# Altium project Luna v2.PrjPcb (part 1 of 7)
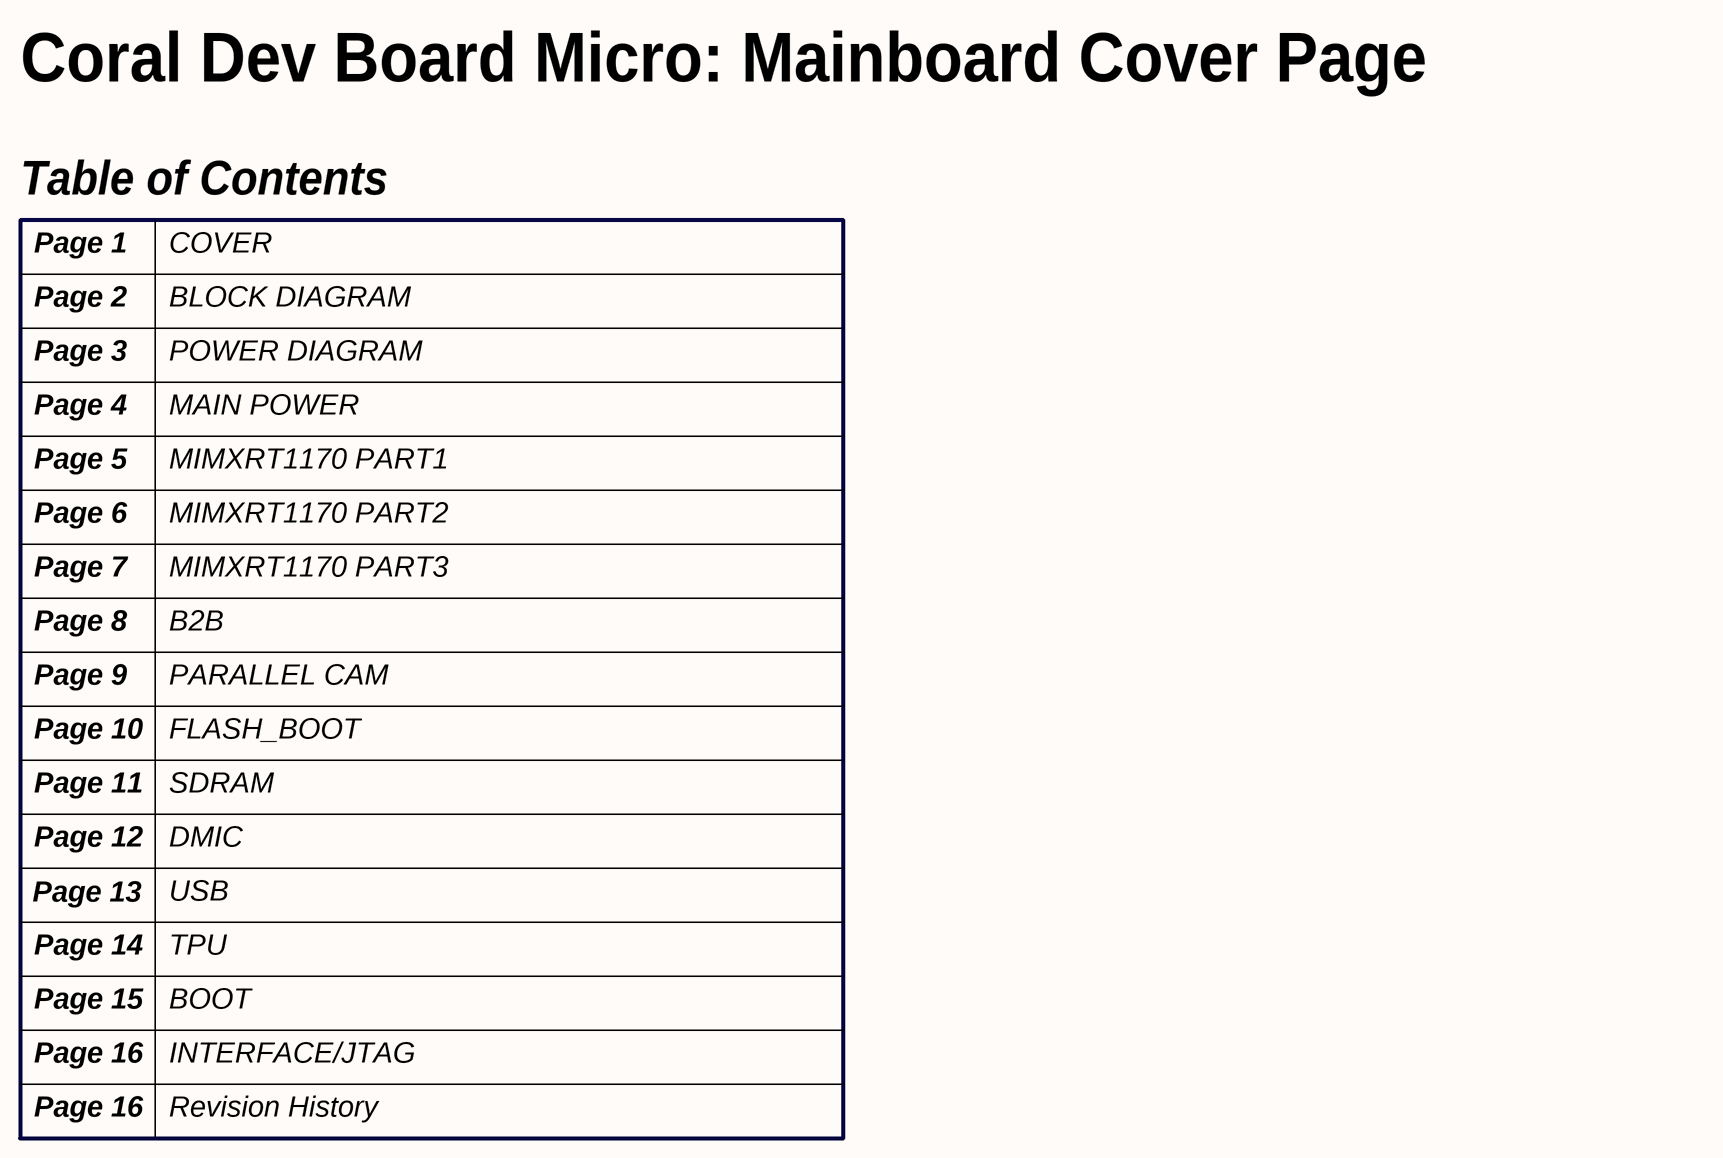
[diagram p0: 01 COVER.SchDoc]
ProjectRevision: PVT; Title: Luna v2
20 sheets, 413 parts. Net scope: flat (ports and power ports of the same name join across sheets).
Board file: Coral Dev Board Micro.PcbDoc
Sheets:
  01 COVER.SchDoc
  02 BLOCK DIAGRAM.SchDoc
  03 POWER DIAGRAM.SchDoc
  Analog Sense.SchDoc
  04 MAIN POWER.SchDoc
  05 MIMXRT1170 PART1.SchDoc
  06 MIMXRT1170 PART2.SchDoc
  07 MIMXRT1170 PART3.SchDoc
  08 B2B.SchDoc
  09 Parallel Camera.SchDoc
  10 FLASH_BOOT.SchDoc
  11 SDRAM.SchDoc
  12 DMIC.SchDoc
  13 USB.SchDoc
  14 TPU.SchDoc
  15 BOOT.SchDoc
  16 INTERFACE.SchDoc
  17 Revision History.SchDoc
  POWER.SchDoc
  Heater.SchDoc

## Sheet 01 COVER.SchDoc: Luna v2
size A2; VersionControl_RevNumber: DNP; IsUserConfigurable: DNP; OrgAddr3: Sunrise FL 33323; OrgName: Pixels on Target; Page Create Date: March  8, 1995; Page Number: 5; Page Size: A2; Page Count: 14; OrgAddr2: Suite #104; RevCode: A; Doc: SCH30-00070-00; DsnPath: C:\Users\Carter Nichols\Documents\BitBucket boards (Cadence)\30-00070-00_Original\SCH30-00070-00.DSN; SchematicName: SC30-00070-00; PageName: 05-POWER IN; PageSize: A2; TopSchematic: True; Address4: United States

### Notes on the sheet
- Coral Dev Board Micro: Mainboard Cover Page
- Table of Contents
- Page 1
- Page 2
- COVER
- BLOCK DIAGRAM
- Page 3
- POWER DIAGRAM
- Page 4
- MAIN POWER
- Page 5
- MIMXRT1170 PART1
- Page 6
- Page 7
- MIMXRT1170 PART3
- MIMXRT1170 PART2
- Page 8
- B2B
- Page 9
- PARALLEL CAM
- Page 10
- FLASH_BOOT
- Page 11
- Page 12
- SDRAM
- DMIC
- Page 13
- USB
- Page 14
- TPU
- Page 15
- BOOT
- Page 16
- INTERFACE/JTAG
- Revision History
- Title
- Size:
- Date:
- File:
- A2
- Number:
- Time:
- Revision:
- Sheet
- of

## Sheet 02 BLOCK DIAGRAM.SchDoc: Luna v2
size A2; VersionControl_RevNumber: DNP; IsUserConfigurable: DNP; OrgAddr3: Sunrise FL 33323; OrgName: Pixels on Target; Page Create Date: March  8, 1995; Page Number: 5; Page Size: A2; Page Count: 14; OrgAddr2: Suite #104; RevCode: A; Doc: SCH30-00070-00; DsnPath: C:\Users\Carter Nichols\Documents\BitBucket boards (Cadence)\30-00070-00_Original\SCH30-00070-00.DSN; SchematicName: SC30-00070-00; PageName: 05-POWER IN; PageSize: A2; TopSchematic: True; Address4: United States
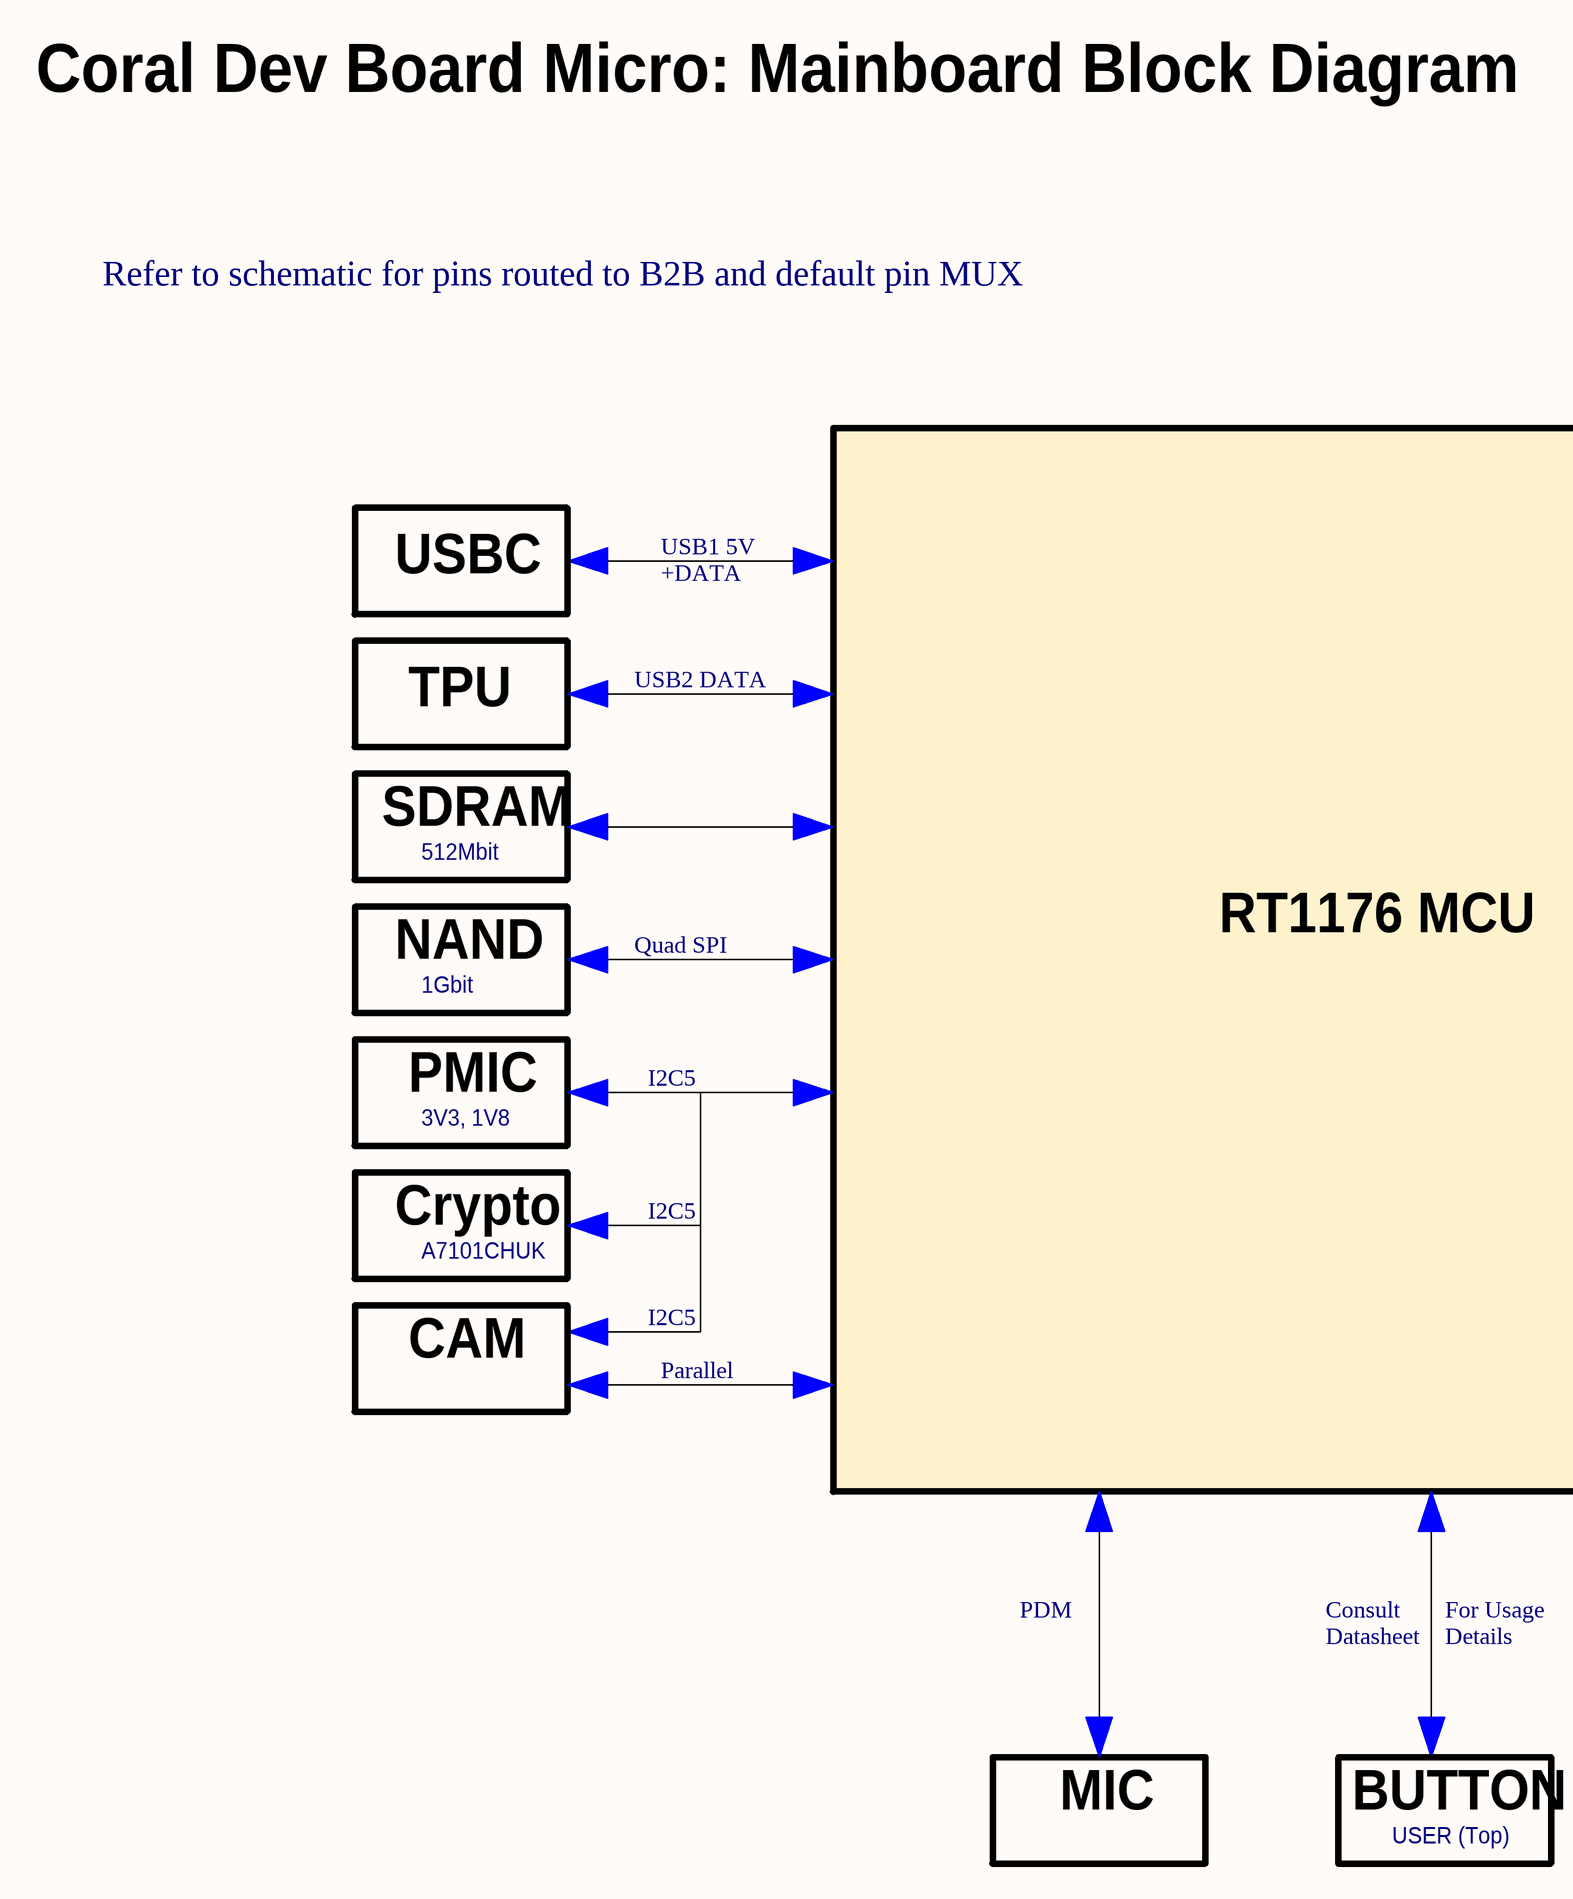
[diagram p1: 02 BLOCK DIAGRAM.SchDoc, left]
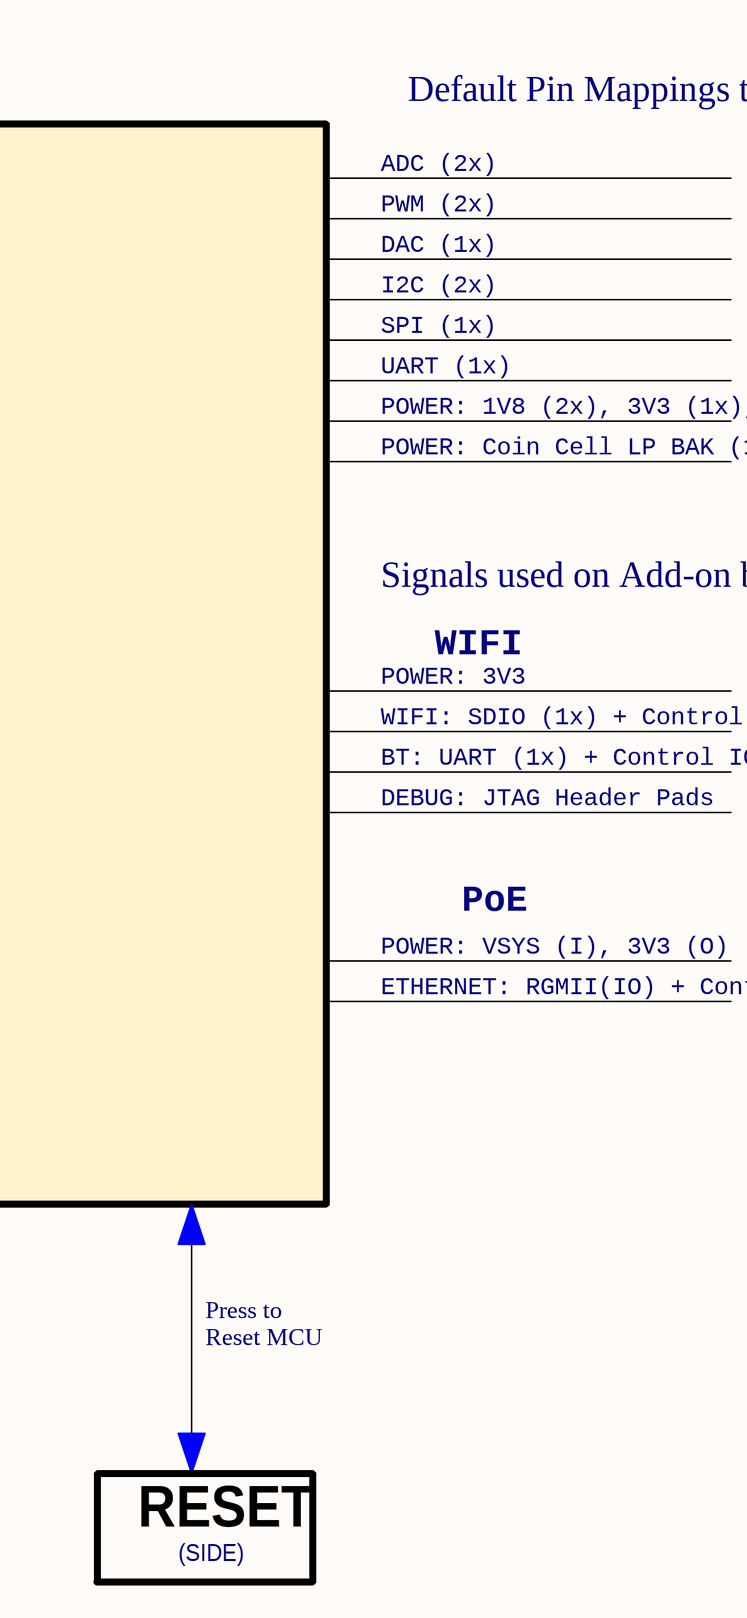
[diagram p2: 02 BLOCK DIAGRAM.SchDoc, right]

### Notes on the sheet
- Coral Dev Board Micro: Mainboard Block Diagram
- Refer to schematic for pins routed to B2B and default pin MUX
- Default Pin Mappings to Header
- ADC (2x)
- PWM (2x)
- USBC
- USB1 5V
- +DATA
- DAC (1x)
- I2C (2x)
- SPI (1x)
- TPU
- USB2 DATA
- UART (1x)
- POWER: 1V8 (2x), 3V3 (1x), VSYS 5V (1x)
- POWER: Coin Cell LP BAK (1x)
- SDRAM
- 512Mbit
- Signals used on Add-on boards at Release Time
- NAND
- Quad SPI
- RT1176 MCU
- POWER: 3V3
- WIFI
- 1Gbit
- WIFI: SDIO (1x) + Control IO
- PMIC
- I2C5
- BT: UART (1x) + Control IO
- DEBUG: JTAG Header Pads
- 3V3, 1V8
- Crypto
- POWER: VSYS (I), 3V3 (O)
- PoE
- A7101CHUK
- ETHERNET: RGMII(IO) + Control IO
- CAM
- Parallel
- PDM
- Consult
- Datasheet
- For Usage
- Details
- Press to
- Reset MCU
- MIC
- BUTTON
- USER (Top)
- RESET
- (SIDE)
- Title
- Size:
- Date:
- File:
- A2
- Number:
- Time:
- Revision:
- Sheet
- of

## Sheet 03 POWER DIAGRAM.SchDoc: Luna v2
size A2; VersionControl_RevNumber: DNP; IsUserConfigurable: DNP; OrgAddr3: Sunrise FL 33323; OrgName: Pixels on Target; Page Create Date: March  8, 1995; Page Number: 5; Page Size: A2; Page Count: 14; OrgAddr2: Suite #104; RevCode: A; Doc: SCH30-00070-00; DsnPath: C:\Users\Carter Nichols\Documents\BitBucket boards (Cadence)\30-00070-00_Original\SCH30-00070-00.DSN; SchematicName: SC30-00070-00; PageName: 05-POWER IN; PageSize: A2; TopSchematic: True; Address4: United States
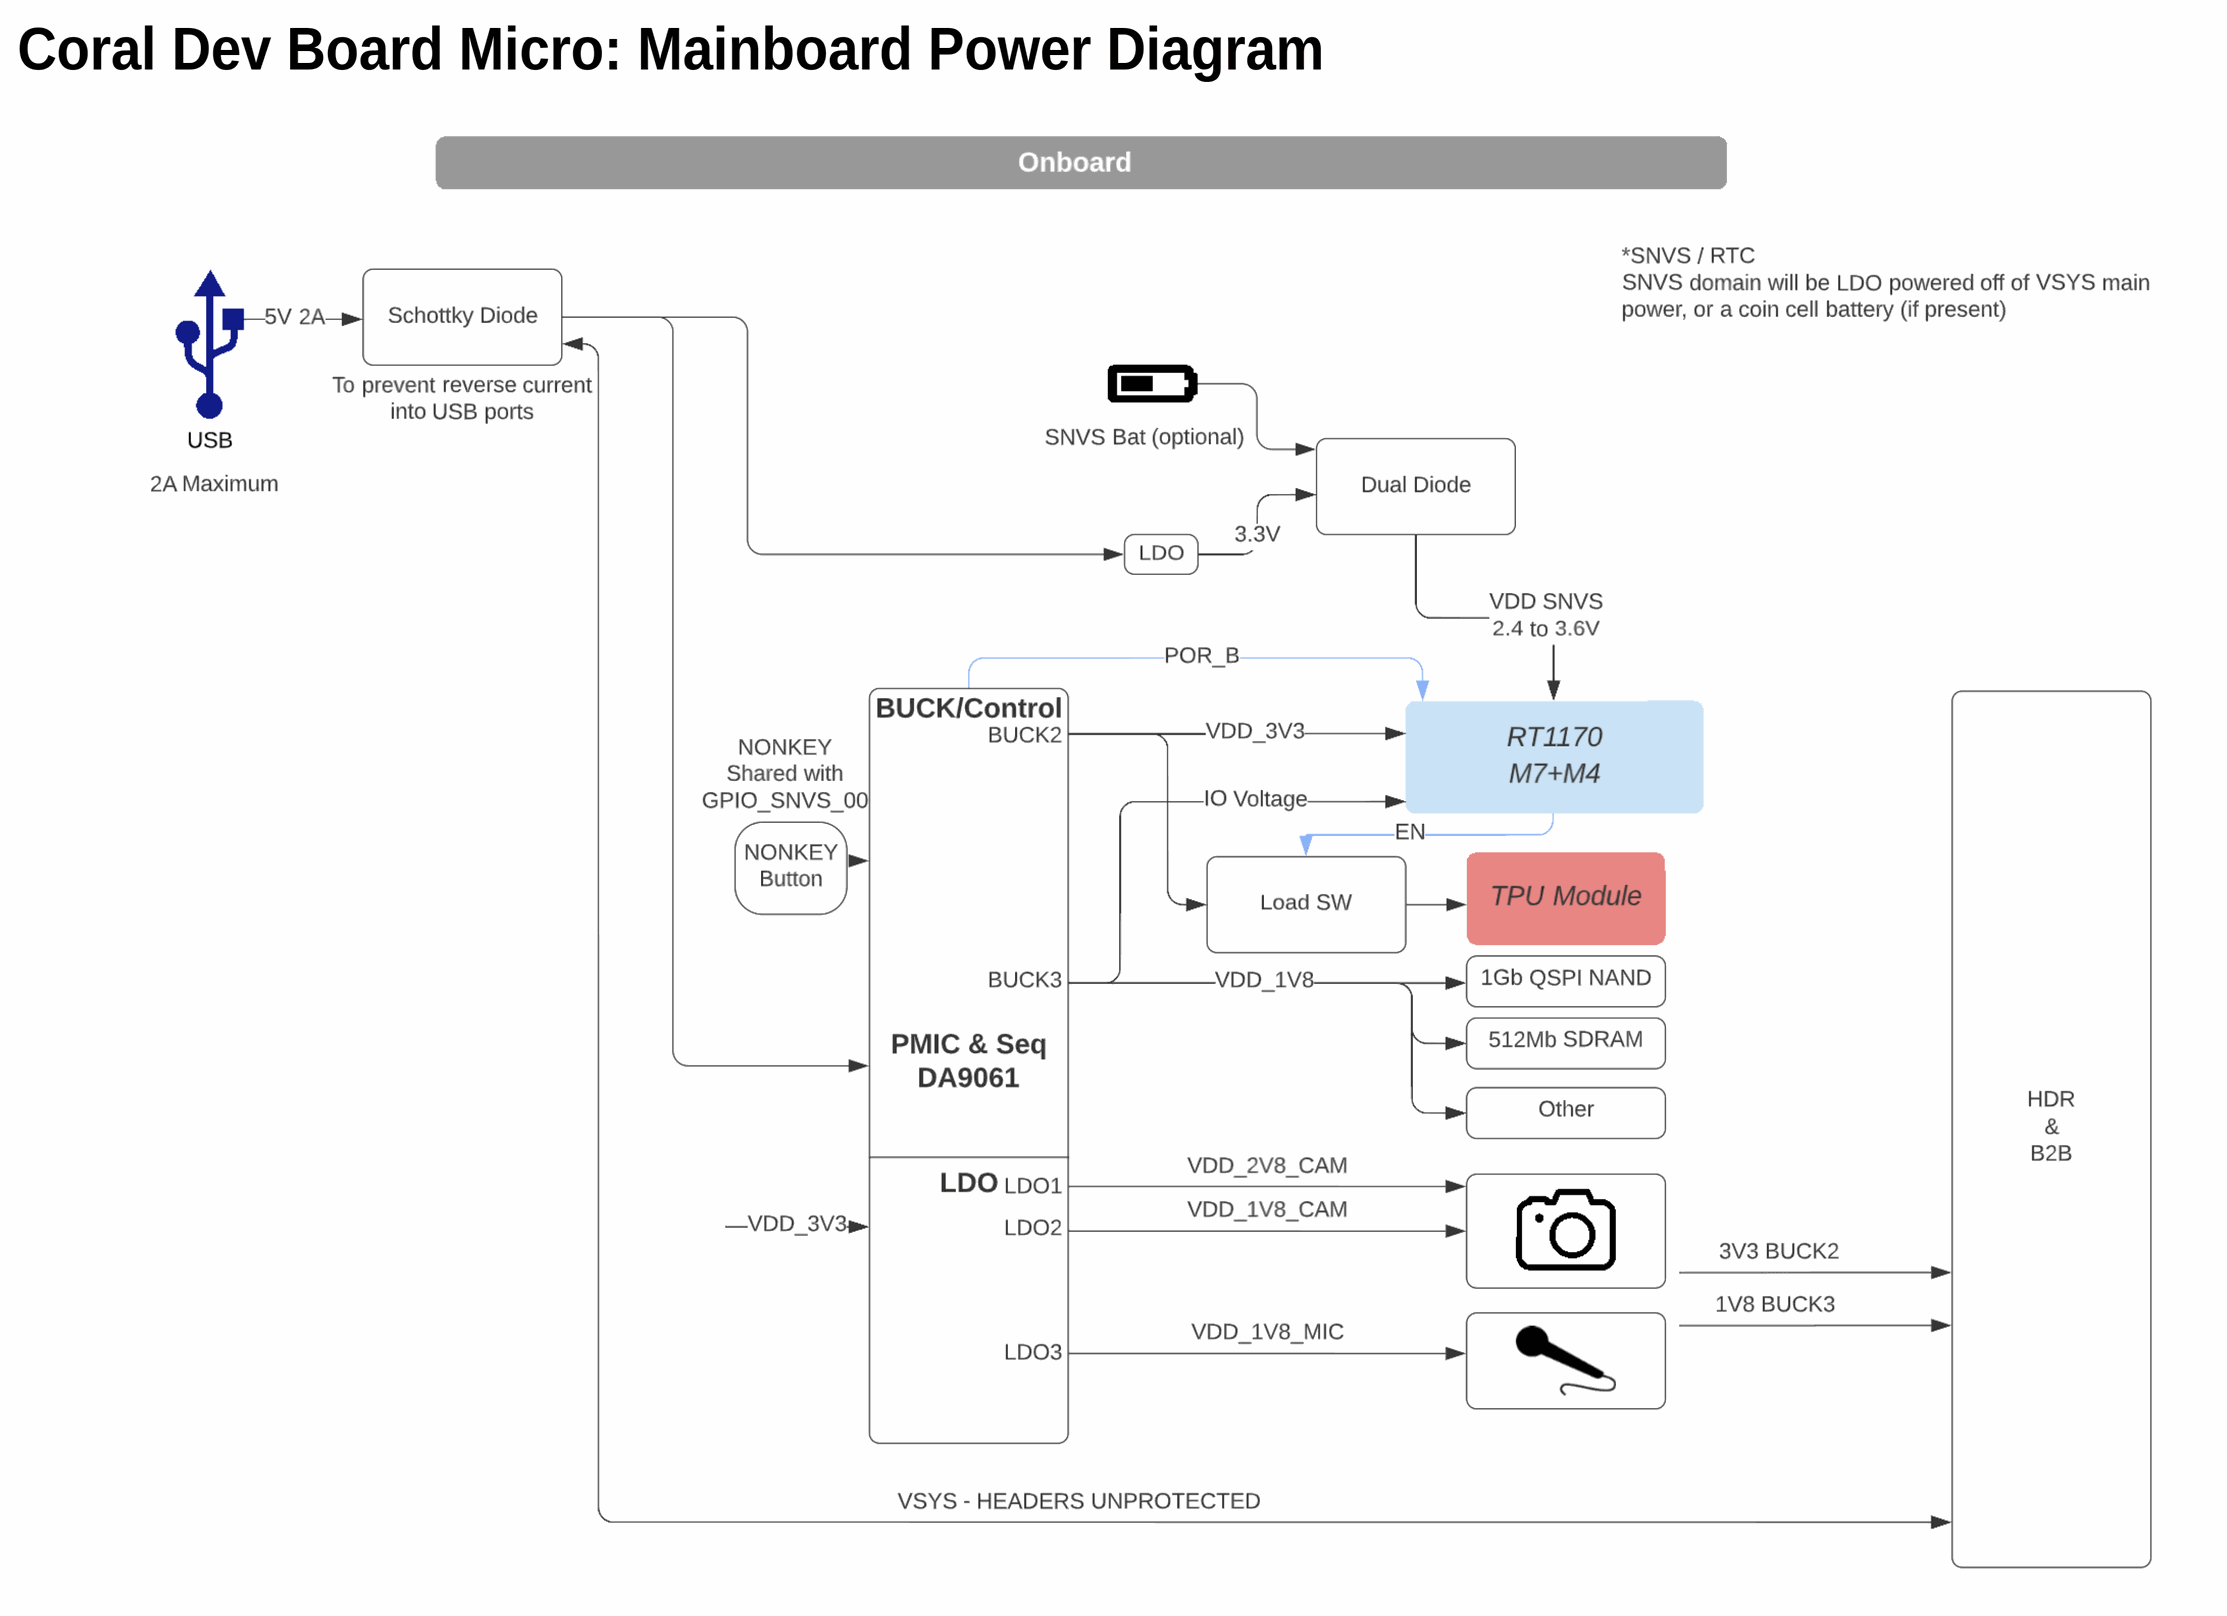
[diagram p3: 03 POWER DIAGRAM.SchDoc]

### Notes on the sheet
- Coral Dev Board Micro: Mainboard Power Diagram
- Title
- Size:
- Date:
- File:
- A2
- Number:
- Time:
- Revision:
- Sheet
- of

## Sheet Analog Sense.SchDoc: Luna v2
size A2; VersionControl_RevNumber: DNP; IsUserConfigurable: DNP; Page Size: A2; RevCode: A; PageSize: A2; TopSchematic: True; Address4: United States
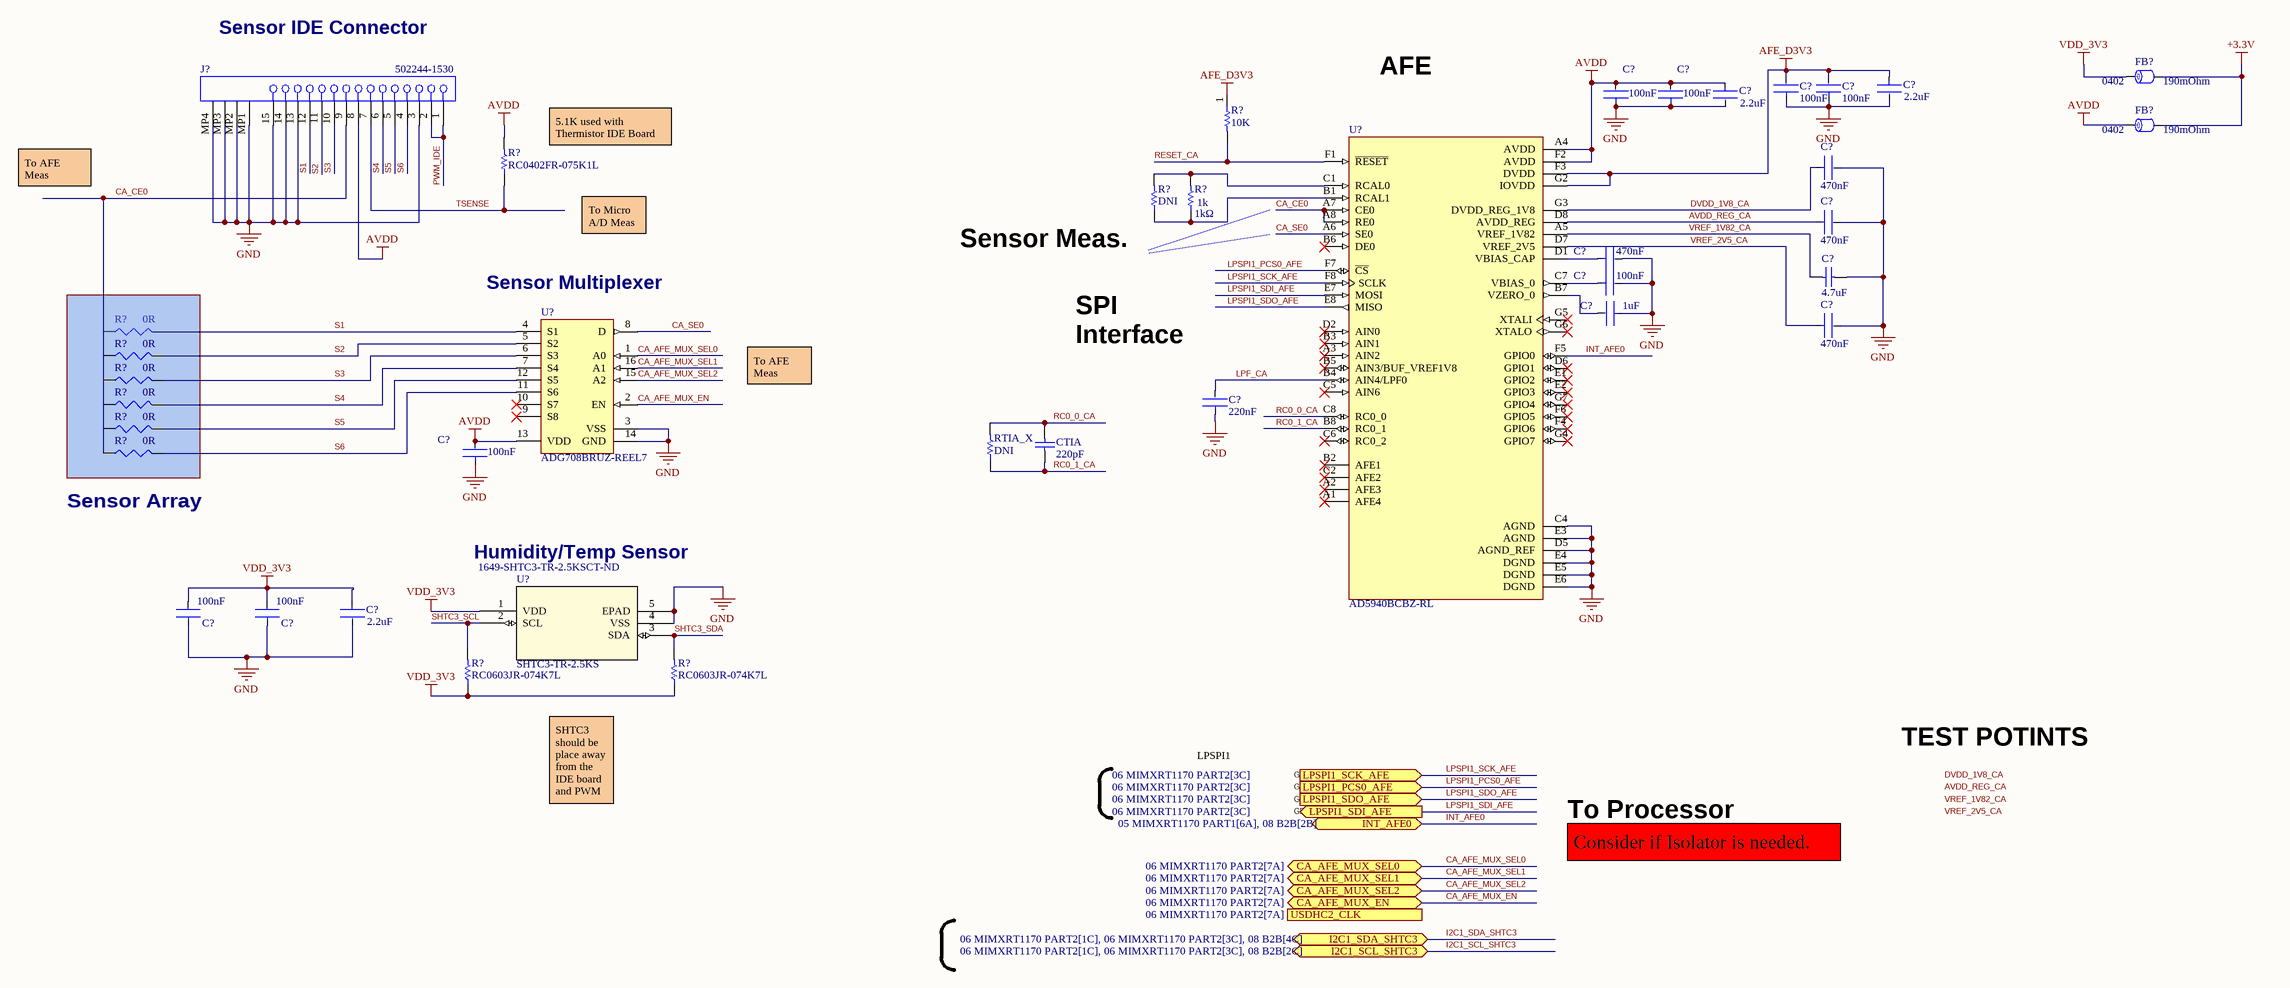
[diagram p4: Analog Sense.SchDoc]

### Parts
(Parts that share a designator on the sheet are numbered #1, #2 ... from top to bottom, then left to right.)
C?#1  Capacitance: 2.2uF  [FP-GRM155-0_2-IPC_B]  (hidden comment: GRM155R61C225KE11D)
C?#2  Capacitance: 2.2uF  [FP-GRM155-0_2-IPC_B]  (hidden comment: GRM155R61C225KE11D)
C?#3  value 100nF  [FP-C0603-CJ-MFG]  (hidden comment: C0603X104K5RACTU)
C?#4  value 100nF  [FP-C0603-CJ-MFG]  (hidden comment: C0603X104K5RACTU)
C?#5  value 100nF  [FP-C0603-CJ-MFG]  (hidden comment: C0603X104K5RACTU)
C?#6  value 100nF  [FP-C0603-CJ-MFG]  (hidden comment: C0603X104K5RACTU)
C?#7  Capacitance: 470nF  [FP-GRM188-0_1-e0_2_0_5-IPC_B]  (hidden comment: GRM188R71C474KA88D)
C?#8  Capacitance: 470nF  [FP-GRM188-0_1-e0_2_0_5-IPC_B]  (hidden comment: GRM188R71C474KA88D)
C?#9  Capacitance: 470nF  [FP-GRM188-0_1-e0_2_0_5-IPC_B]  (hidden comment: GRM188R71C474KA88D)
C?#10  4.7uF  [0603_CAP_NP]
C?#11  Capacitance: 100nF  [FP-C0603-CJ-MFG]  (hidden comment: C0603X104K5RACTU)
C?#12  Capacitance: 1uF  [FP-C1608-080-0_1-IPC_B]  (hidden comment: C1608X5R1H105K080AB)
C?#13  Capacitance: 470nF  [FP-GRM188-0_1-e0_2_0_5-IPC_B]  (hidden comment: GRM188R71C474KA88D)
C?#14  Capacitance: 220nF  [FP-GRM155-0_05-IPC_A]  (hidden comment: GRM155R61A224KE19D)
C?#15  value 100nF  [FP-C0603-CJ-MFG]  (hidden comment: C0603X104K5RACTU)
C?#16  Capacitance: 2.2uF  [FP-GRM155-0_2-IPC_B]  (hidden comment: GRM155R61C225KE11D)
C?#17  value 100nF  [FP-C0603-CJ-MFG]  (hidden comment: C0603X104K5RACTU)
C?#18  value 100nF  [FP-C0603-CJ-MFG]  (hidden comment: C0603X104K5RACTU)
CTIA  220pF  [CAPC1005X56X25LL10T15]
FB?#1  Package: 0402  Rdc max: 190mOhm  [L0402_H0.55MM]  (hidden comment: __Template_Ferrite_Bead)
FB?#2  Package: 0402  Rdc max: 190mOhm  [L0402_H0.55MM]  (hidden comment: __Template_Ferrite_Bead)
J?#1  502244-1530  [MOLX-502244-1530]
R?#1  Resistance: 10K  [RESC1005X40X25ML05T10]  (hidden comment: CRCW040210K0FKEDHP)
R?#2  RC0402FR-075K1L  [RESC1005X40X25NL05T10]
R?#3  value DNI  [0402_RES]  (hidden comment: 0Ω)
R?#4  1k  value 1kΩ  [0402_RES]
R?#5  0R  [R0805]  (graphical)
R?#6  0R  [R0805]  (graphical)
R?#7  0R  [R0805]  (graphical)
R?#8  0R  [R0805]  (graphical)
R?#9  0R  [R0805]  (graphical)
R?#10  0R  [R0805]  (graphical)
R?#11  RC0603JR-074K7L  [RESC1608X55X25ML10T15]
R?#12  RC0603JR-074K7L  [RESC1608X55X25ML10T15]
RTIA_X  value DNI  [0402_RES]  (hidden comment: 0Ω)
U?#1  ADG708BRUZ-REEL7  [ADI-RU-16_N]
U?#2  AD5940BCBZ-RL  [BGA56N40P7X8_356X416X55N]
U?#3  SHTC3-TR-2.5KS  Supplier Part Number 1: 1649-SHTC3-TR-2.5KSCT-ND  [SHTC3_SEN]

### Ports
CA_AFE_MUX_EN (bidir, see 06 MIMXRT1170 PART2[7A]), CA_AFE_MUX_SEL0 (bidir, see 06 MIMXRT1170 PART2[7A]), CA_AFE_MUX_SEL1 (bidir, see 06 MIMXRT1170 PART2[7A]), CA_AFE_MUX_SEL2 (bidir, see 06 MIMXRT1170 PART2[7A]), I2C1_SCL_SHTC3 (bidir, see 06 MIMXRT1170 PART2[1C], 06 MIMXRT1170 PART2[3C], 08 B2B[2C]), I2C1_SDA_SHTC3 (bidir, see 06 MIMXRT1170 PART2[1C], 06 MIMXRT1170 PART2[3C], 08 B2B[4C]), INT_AFE0 (bidir, see 05 MIMXRT1170 PART1[6A], 08 B2B[2B]), LPSPI1_PCS0_AFE (in, see 06 MIMXRT1170 PART2[3C]), LPSPI1_SCK_AFE (in, see 06 MIMXRT1170 PART2[3C]), LPSPI1_SDI_AFE (out, see 06 MIMXRT1170 PART2[3C]), LPSPI1_SDO_AFE (in, see 06 MIMXRT1170 PART2[3C]), USDHC2_CLK (in, see 06 MIMXRT1170 PART2[7A])

### Nets
+3.3V: FB?#1.2 FB?#2.2
AFE_D3V3: C?#1.1 C?#3.2 C?#4.2 R?#1.1 U?#2.F3(DVDD) U?#2.G2(IOVDD)
AVDD: C?#2.1 C?#5.2 C?#6.2 C?#15.2 FB?#2.1 J?#1.8 R?#2.2 U?#1.13(VDD) U?#2.A4(AVDD) U?#2.F2(AVDD)
GND: C?#1.2 C?#2.2 C?#3.1 C?#4.1 C?#5.1 C?#6.1 C?#7.2 C?#8.2 C?#9.2 C?#10.2 C?#11.2 C?#12.2 C?#13.2 C?#14.1 C?#15.1 C?#16.2 C?#17.1 C?#18.1 J?#1.3 J?#1.13 J?#1.14 J?#1.15 J?#1.MP1 J?#1.MP2 J?#1.MP3 J?#1.MP4 U?#1.3(VSS) U?#1.14(GND) U?#2.C4(AGND) U?#2.D5(AGND_REF) U?#2.E3(AGND) U?#2.E4(DGND) U?#2.E5(DGND) U?#2.E6(DGND) U?#3.4(VSS) U?#3.5(EPAD)
VDD_3V3: C?#16.1 C?#17.2 C?#18.2 FB?#1.1 R?#11.1 R?#12.1 U?#3.1(VDD)
AVDD_REG_CA: C?#8.1 U?#2.D8(AVDD_REG)
CA_AFE_MUX_EN: U?#1.2(EN) ; port CA_AFE_MUX_EN
CA_AFE_MUX_SEL0: U?#1.1(A0) ; port CA_AFE_MUX_SEL0
CA_AFE_MUX_SEL1: U?#1.16(A1) ; port CA_AFE_MUX_SEL1
CA_AFE_MUX_SEL2: U?#1.15(A2) ; port CA_AFE_MUX_SEL2
CA_CE0: J?#1.9 R?#5.1 R?#6.1 R?#7.1 R?#8.1 R?#9.1 R?#10.1 U?#2.A7(CE0) U?#2.A8(RE0)
CA_SE0: U?#1.8(D) U?#2.A6(SE0)
DVDD_1V8_CA: C?#7.1 U?#2.G3(DVDD_REG_1V8)
INT_AFE0: U?#2.F5(GPIO0) ; port INT_AFE0
LPF_CA: C?#14.2 U?#2.B4(AIN4/LPF0)
LPSPI1_PCS0_AFE: U?#2.F7(~{CS}) ; port LPSPI1_PCS0_AFE
LPSPI1_SCK_AFE: U?#2.F8(SCLK) ; port LPSPI1_SCK_AFE
LPSPI1_SDI_AFE: U?#2.E7(MOSI) ; port LPSPI1_SDI_AFE
LPSPI1_SDO_AFE: U?#2.E8(MISO) ; port LPSPI1_SDO_AFE
PWM_IDE: J?#1.1 J?#1.2
RC0_0_CA: CTIA.2 RTIA_X.2 U?#2.C8(RC0_0)
RC0_1_CA: CTIA.1 RTIA_X.1 U?#2.B8(RC0_1)
RESET_CA: R?#1.2 U?#2.F1(~{RESET})
S1: J?#1.12 R?#5.2 U?#1.4(S1)
S2: J?#1.11 R?#6.2 U?#1.5(S2)
S3: J?#1.10 R?#7.2 U?#1.6(S3)
S4: J?#1.6 R?#8.2 U?#1.7(S4)
S5: J?#1.5 R?#9.2 U?#1.12(S5)
S6: J?#1.4 R?#10.2 U?#1.11(S6)
SHTC3_SCL: R?#11.2 U?#3.2(SCL)
SHTC3_SDA: R?#12.2 U?#3.3(SDA)
TSENSE: J?#1.7 R?#2.1
VREF_1V82_CA: C?#10.1 U?#2.A5(VREF_1V82)
VREF_2V5_CA: C?#13.1 U?#2.D7(VREF_2V5)
NetC?#9_1: C?#9.1 U?#2.D1(VBIAS_CAP)
NetC?#11_1: C?#11.1 U?#2.C7(VBIAS_0)
NetC?#12_1: C?#12.1 U?#2.B7(VZERO_0)
NetR?#3_1: R?#3.1 R?#4.1 U?#2.B1(RCAL1)
NetR?#3_2: R?#3.2 R?#4.2 U?#2.C1(RCAL0)

Not connected (* = marked no-connect by the designer): U?#1 9(S8)* 10(S7)*; U?#2 A1(AFE4)* A2(AFE3)* A3(AIN2)* B2(AFE1)* B3(AIN1)* B5(AIN3/BUF_VREF1V8)* B6(DE0)* C2(AFE2)* C5(AIN6)* C6(RC0_2)* D2(AIN0)* D6(GPIO1)* E1(GPIO2)* E2(GPIO3)* F4(GPIO6)* F6(GPIO5)* G4(GPIO7)* G5(XTALI)* G6(XTALO)* G7(GPIO4)*

### Notes on the sheet
- Sensor IDE Connector
- AFE
- To AFE Meas
- (near R?#2) 5.1K used with Thermistor IDE Board
- (near R?#3) CALIBRATION
- To Micro A/D Meas
- (near U?#1) Sensor Multiplexer
- (near R?#3) Sensor Meas. Inputs
- To AFE  Meas
- TIA FILTER
- (near C?#14) SPI Interface
- (near R?#10) Sensor Array
- (near U?#3) Humidity/Temp Sensor
- SHTC3 should be place away from the IDE board and PWM FET to pick up closer to ambient temperature
- LPSPI1
- GPIO_AD_28
- GPIO_AD_29
- TEST POTINTS
- GPIO_AD_30
- GPIO_AD_31
- To Processor
- Consider if Isolator is needed.
- Labels drawn without touching a wire or pin: AVDD_REG_CA, DVDD_1V8_CA, VREF_1V82_CA, VREF_2V5_CA
- Title
- Size:
- Date:
- File:
- A2
- Number:
- Time:
- Revision:
- Sheet
- of

### Library data of the parts
C?#1 C?#2 C?#16 = CMP-06035-001793-1: Chip Multilayer Ceramic Capacitors for General Purpose, 0402, 2.2uF, X5R, 15%, 10%, 16V; Tolerance: 10%; Packaging: Tape and Reel; Lead Free: Lead Free; Mount: Surface Mount; Width: 0.02inch; Case/Package: 0402; Case Code (Metric): 1005; Thickness: 0.022inch; Max Operating Temperature: 85°C; Min Operating Temperature: -55°C; Voltage Rating: 16V; Voltage Rating (DC): 16V; Material: Ceramic; Height: 0.3mm; Case Code (Imperial): 0402; Length: 0.039inch
C?#3-C?#6 C?#15 C?#17 C?#18 = CMP-2006-03300-2: CAP CER 0.1UF 50V X7R 0603; Manufacturer: Kemet; Material: Ceramic; Tolerance: 10%; Temperature Coefficient: 15%; Temperature Range High: +125°C; Temperature Range Low: -55°C; Manufacturer Part Number: C0603X104K5RACTU; Voltage: 50V; ComponentLink2Description: Datasheet; RoHS: TRUE; ComponentLink2URL: https://content.kemet.com/datasheets/KEM_C1013_X7R_FT-CAP_SMD.pdf; Capacitance: 100nF; Device Class L3: Ceramic Capacitors; Device Class L2: Capacitors; Package: C0603-CJ; Height: 0.95mm; Device Class L1: Passive Components; Temperature Characteristic: X7R; Lead Free: Yes; Digikey Description: CAP CER 0.1UF 50V X7R 0603; Automotive: No; Mouser Description: Capacitor; Ceramic; Cap 0.1uF; Tol+10%; SMT; Flexible Termination; Vol-Rtg 50V; TR; Temperature: -55°C to +125°C; Octopart: https://octopart.com/c0603x104k5ractu-kemet-9145062; Category: Cap; Voltage Rating: 50V; Ipc Land Pattern Name: CAPC16080X80
C?#7-C?#9 C?#13 = CMP-2006-02860-2: Chip Multilayer Ceramic Capacitors for General Purpose, 0603, 0.47uF, X7R, 15%, 10%, 16V; Material: Ceramic; Termination: SMD/SMT; Case Code (Imperial): 0603; Height: 0.8mm; Dielectric: X7R; Length: 1.6mm; Packaging: Tape and Reel; Mount: Surface Mount; Thickness: 0.035inch; Voltage Rating (DC): 16V; Case Code (Metric): 1608; REACH SVHC: No SVHC; Depth: 0.8mm; Number of Pins: 2; Max Operating Temperature: 125°C; Min Operating Temperature: -55°C; Width: 0.8mm; Voltage: 16V; Lead Free: Lead Free; Voltage Rating: 16V; Package Quantity: 1; Case/Package: 0603; Tolerance: 10%
C?#10 = 0603C_4.7uF_6.3V_10%_X7R: Ceramic Cap 4.7µF ±10% 6.3V X7R 0603; MPN: CL10B475KQ8NQNC; Mfg: Samsung; Unit Cost, Qty 1: $0.10; Unit Cost, Qty 500: $0.023; Value: 4.7uF
C?#11 = CMP-2006-03300-2: CAP CER 0.1UF 50V X7R 0603; Manufacturer: Kemet; Material: Ceramic; Tolerance: 10%; Value: 100nF; Temperature Coefficient: 15%; Temperature Range High: +125°C; Temperature Range Low: -55°C; Manufacturer Part Number: C0603X104K5RACTU; Voltage: 50V; ComponentLink2Description: Datasheet; RoHS: TRUE; ComponentLink2URL: https://content.kemet.com/datasheets/KEM_C1013_X7R_FT-CAP_SMD.pdf; Device Class L3: Ceramic Capacitors; Device Class L2: Capacitors; Package: C0603-CJ; Height: 0.95mm; Device Class L1: Passive Components; Temperature Characteristic: X7R; Lead Free: Yes; Digikey Description: CAP CER 0.1UF 50V X7R 0603; Automotive: No; Mouser Description: Capacitor; Ceramic; Cap 0.1uF; Tol+10%; SMT; Flexible Termination; Vol-Rtg 50V; TR; Temperature: -55°C to +125°C; Octopart: https://octopart.com/c0603x104k5ractu-kemet-9145062; Category: Cap; Voltage Rating: 50V; Ipc Land Pattern Name: CAPC16080X80
C?#12 = CMP-2000-06025-2: Multilayer Ceramic Capacitors 1μF ±10% 50V X5R SMD 0603; Series: C; Tolerance: 10%; Packaging: Tape and Reel; Lead Free: Lead Free; Height: 0.8mm; Mount: Surface Mount; Radiation Hardening: No; Thickness: 0.035inch; Length: 1.6mm; Max Operating Temperature: 85°C; REACH SVHC: No SVHC; Min Operating Temperature: -55°C; Construction: Flat; RoHS Compliant: Yes; Voltage Rating: 50V; Dielectric: X5R; Termination: SMD/SMT; Voltage Rating (DC): 50V; Case Code (Imperial): 0603; Voltage: 50V; Width: 0.031inch; Weight: 7.1E-05oz; Depth: 0.8mm; Case Code (Metric): 1608; Case/Package: 0603; Resistor Type: Ceramic; Number of Pins: 2; Dielectric Material: Ceramic; Package Quantity: 1
C?#14 = CMP-2008-04561-5: CAP CER 0.22UF 10V X5R 0402; Tolerance: 10%; Material: Ceramic; Insulation Resistance: 10GR; Max Operating Temperature: 85°C; Package Quantity: 1; Height: 0.5mm; Case Code (Metric): 1005; Case Code (Imperial): 0402; Length: 1mm; Voltage Rating: 10V; Radiation Hardening: No; Voltage Rating (DC): 10V; Width: 0.5mm; REACH SVHC: No SVHC; Min Operating Temperature: -55°C; Mount: Surface Mount; Packaging: Tape and Reel; Termination: SMD/SMT; Voltage: 10V; Thickness: 0.022inch; Lead Free: Lead Free; Number of Pins: 2; Case/Package: 0402; Dielectric: X5R; Depth: 0.5mm; Series: GRM; RoHS Compliant: Yes; Dielectric Material: Ceramic
CTIA = CMP-2008-02709-1: CAP CER 220PF 50V X7R 0402 04025C221JAT2A; Manufacturer: AVX Interconnect / Elco; Part Number: 04025C221JAT2A
FB?#1 FB?#2 = 913: FERRITE, BEAD, 120 OHMS@100MHZ, 25%, 550mA, 190 mOHM DCR, 0402; ID: 913; Catagory: Ferrite Bead; MFG: Murata Electronics; MFG P/N: BLM15AG121SN1D; ComponentLink1Description: Datasheet; Status: Released; Idc max: 550mA; Supplier 1: Digi-Key; HelpURL: https://www.digikey.com/product-detail/en/murata-electronics/BLM15AG121SN1D/490-1005-1-ND/584453; ComponentLink1URL: https://www.murata.com/en-us/products/productdata/8796740059166/ENFA0018.pdf; Height: 0.55mm; Supplier Part Number 1: 490-1005-1-ND
J?#1 = CMP-1243-00004-1: 0.5 mm Pitch Easy-On(TM) Type FFC Connector, for LVDS, 2.33 mm Mated Height, Right Angle, ZIF, SMT, Bottom Contact, 15 Circuits, -25 to 85 degC, ELV and RoHS Compliant, Tape and Reel; Manufacturer: Molex; Pitch - Mating Interface: 0.50mm; Circuits (Loaded): 15; Material - Plating Termination: Gold; PCB Locator: No; Voltage (Max): 50V AC (RMS)/DC; Current (Max per Contact): 0.4A; Mated Height: 2.33mm; Material - Metal: Phosphor Bronze; PCB Retention: Yes; Durability (mating cycles max): 20; Entry Angle: 90degrees Angle; Mounting Technology: Surface Mount; ComponentLink1URL: http://www.molex.com/molex/index.jsp; PackageDescription: 15-Lead FFC Connector, Pitch 0.5 mm; PartNumber: 502244-1530; PackageReference: 502244-1530; Orientation: Right Angle; Number of Rows: 1; Material - Plating Mating: Gold; Contact Position: Bottom; Packing: Tape and Reel; Polarized to PCB: Yes; RoHS: TRUE; ComponentLink2URL: http://www.molex.com/webdocs/datasheets/pdf/en-us/5022441530_FFC_FPC_CONNECTORS.pdf; PackageVersion: Rev. C, 03/2010; Stackable: No; ComponentLink1Description: Manufacturer URL; ComponentLink2Description: Datasheet; ComponentLink3Description: Package Specification; ComponentLink3URL: http://www.molex.com/pdm_docs/sd/5022441530_sd.pdf
R?#1 = CMP-2002-03043-1: Thick Film Resistors - SMD 0.2W 10Kohms 1% High Power AEC-Q200; Manufacturer: Vishay Dale; Part Number: CRCW040210K0FKEDHP
R?#2 = CMP-2002-07753-1: 5.1 kOhms ±1% 0.063W, 1/16W Chip Resistor 0402 (1005 Metric) Moisture Resistant Thick Film; Manufacturer: Yageo / Phycomp; Part Number: RC0402FR-075K1L
R?#3 RTIA_X = 0402R_0_0.063W: DNI 0402; Unit Cost, Qty 1: $0.10; Unit Cost, Qty 500: $0.00234; Mfg: DNI; MPN: DNI
R?#4 = 0402R_1k_1%_0.063W: RES SMD 1K OHM 1% 1/16W 0402; MPN: RC0402JR-071KL; Mfg: Yageo; Unit Cost, Qty 1: $0.10; Unit Cost, Qty 500: $0,00298
R?#5-R?#10 = RC0805FR-070RL: RES SMD 0 Ohm Thick Film 0805; Manufacturer: Yageo; Resistance: 0mR; Tolerance: 1%; Power Rating: 125mW; Supplier 1: Digi-Key; Manufacturer Part Number: RC0805FR-070RL; RoHS: Yes; Category: Chip SMD Resistors; Stock 1: 1094; Pricing 1: 1=0.10000, 10=0.03200, 25=0.02360, 50=0.01780, 100=0.01320, 250=0.01004, 500=0.00802, 1000=0.00591 (USD); Case/Package: 0805; Contact Plating: Tin,Matte; Case Code (Imperial): 0805; Case Code (Metric): 2012; Size Code: 0805; Min Operating Temperature: -55°C; Max Operating Temperature: 155°C; Resistor Type: Thick Film; Packaging: Tape and Reel; Features: Moisture Resistant; Series: RC; Max Power Dissipation: 125mW; Number of Terminations: 2; Construction: Rectangular; Length: 2mm; Depth: 1.25mm; Radiation Hardening: No; Military Standard: Not; Lead Free: Lead Free; RoHS Compliant: Yes; ComponentLink1URL: https://datasheet.ciiva.com/15189/getdatasheetpartid-348154-15189885.pdf?src-supplier=Verical; ComponentLink1Description: https://datasheet.ciiva.com/15189/getdatasheetpartid-348154-15189885.pdf?src-supplier=Verical; ComponentLink2URL: https://datasheet.ciiva.com/17042/rc0805-17042698.pdf?src-supplier=Future+Electronics; ComponentLink2Description: https://datasheet.ciiva.com/17042/rc0805-17042698.pdf?src-supplier=Future+Electronics; Supplier Part Number 1: 311-0.0CRCT-ND
R?#11 R?#12 = CMP-2000-05024-1: Chip Resistor, 4.7 KOhm, +/- 5%, 100 mW, -55 to 155 degC, 0603 (1608 Metric), RoHS, Tape and Reel; Manufacturer: Yageo; Resistance: 4.7kOhms; Temperature Coefficient: 100PPM/C; Power Rating: 100mW; Voltage Rating: 50V; Operating Temperature Range: -55Cto+155C; Case Code - mm: 1608; Tolerance: 5%; Product: ThickFilmResistorsGeneralPurpose; Case Code - in: 0603; Datasheet URL: http://www.yageo.com/documents/recent/PYu-RC_Group_51_RoHS_L_04.pdf; Package Reference: 603; Datasheet Version: Rev. 4, 02/2016; Package Description: 2-Pin Surface Mount Device, Body 1.6 x 0.8 mm; Manufacturer URL: http://www.yageo.com/; Series: RC; Packaging: Reel; Termination Style: SMD/SMT
U?#1 = CMP-0798-00194-1: 1.8 to 5.5 V / +/-2.5 V, CMOS Low Voltage 3 Ohm, 8-Channel Multiplexer, -40 to 125 degC, 16-pin SOP (RU-16), Reel; Manufacturer: Analog Devices; Ron (ohms): 3; t transition (s): 14n; Max Analog Signal Range: Vss to Vdd; Bandwidth (Hz): 55M; Supply V Guar Performance: Dual_(+/-2.5V), Single_(+3V), Single_(+5V); PartNumber: ADG708BRUZ-REEL7; PackageReference: RU-16; PackageDescription: 16-Pin Thin Shrink Small Outline Package, Body 5 x 4.4 mm, Pitch 0.65 mm; Code_JEDEC: MO-153AB; ComponentLink1Description: Manufacturer URL; PackageVersion: Nov-02; ComponentLink1URL: http://www.analog.com/en/index.html; ComponentLink2Description: Datasheet; Mounting Technology: Surface Mount; ComponentLink3URL: http:/www.analog.com/static/imported-files/packages/36244347913743854010197452789RU16.pdf; ComponentLink3Description: Package Specification; DatasheetVersion: Rev. C; Packing: Reel; ComponentLink2URL: http://www.analog.com/static/imported-files/data_sheets/ADG708_709.pdf
U?#2 = AD5940BCBZ-RL: AFE Electrochemical Measurement 1 ADC 16bit 3.3V 56-Pin WLCSP T/R; Manufacturer: Analog Devices; Interface: Analog; Operating Supply Current: 300uA; Supplier 1: Digikey; Supplier Part Number 1: 505-AD5940BCBZ-RLCT-ND; Manufacturer Part Number: AD5940BCBZ-RL; RoHS: Yes; Category: Analog to Digital Converters (ADCs); Stock: 4230; Pricing: 1=13.27, 10=9.176, 25=8.108, 100=6.9004, 250=6.68752 (USD); Pins: 56; Output Type: Analog; RoHS Compliant: Yes
U?#3 = SHTC3-TR-2.5KS: Humidity Temperature Sensor 0 ~ 100% RH I²C ±2% RH 8 s Surface Mount; Mfr_Name: Sensirion; Copyright: Copyright (C) 2022 Ultra Librarian. All rights reserved.; Manufacturer_Part_Number: SHTC3-TR-2.5KS; Digi-Key_Part_Number_1: 1649-SHTC3-TR-10kSCT-ND; Digi-Key_Part_Number_2: 1649-SHTC3-TR-10kSDKR-ND; Digi-Key_Part_Number_3: 1649-SHTC3-TR-10kSTR-ND; Digi-Key_Part_Number_4: 1649-SHTC3-TR-2.5KSCT-ND; Digi-Key_Part_Number_5: 1649-SHTC3-TR-2.5KSDKR-ND; Digi-Key_Part_Number_6: 1649-SHTC3-TR-2.5KSTR-ND; RefDes: RefDes; Type: DEV; Supplier 1: Digi-Key

## Sheet 04 MAIN POWER.SchDoc: Luna v2
size A2; VersionControl_RevNumber: DNP; IsUserConfigurable: DNP; OrgAddr3: Sunrise FL 33323; OrgName: Pixels on Target; Page Create Date: March  8, 1995; Page Number: 5; Page Size: A2; Page Count: 14; OrgAddr2: Suite #104; RevCode: A; Doc: SCH30-00070-00; DsnPath: C:\Users\Carter Nichols\Documents\BitBucket boards (Cadence)\30-00070-00_Original\SCH30-00070-00.DSN; SchematicName: SC30-00070-00; PageName: 05-POWER IN; PageSize: A2; TopSchematic: True; Address4: United States
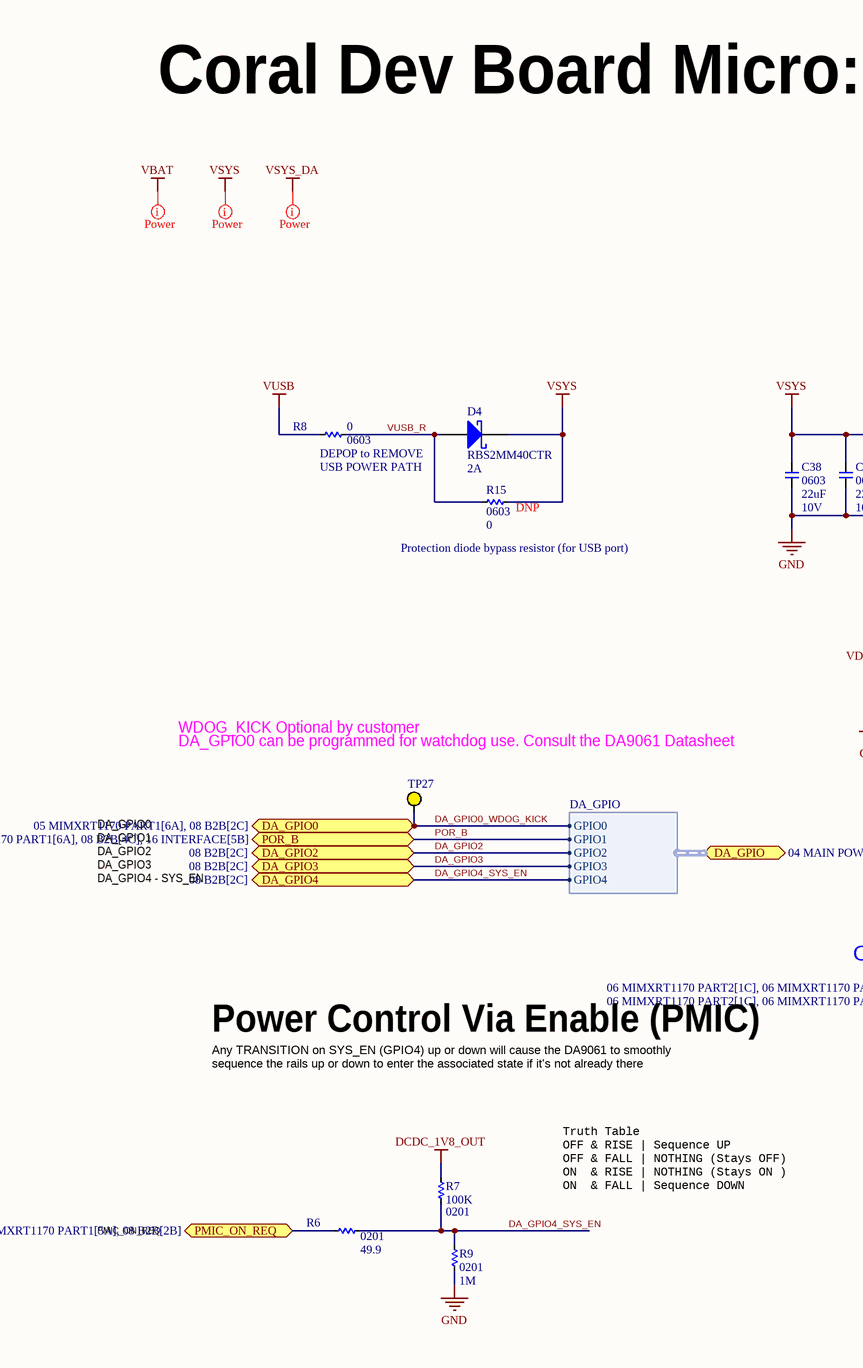
[diagram p5: 04 MAIN POWER.SchDoc, left]
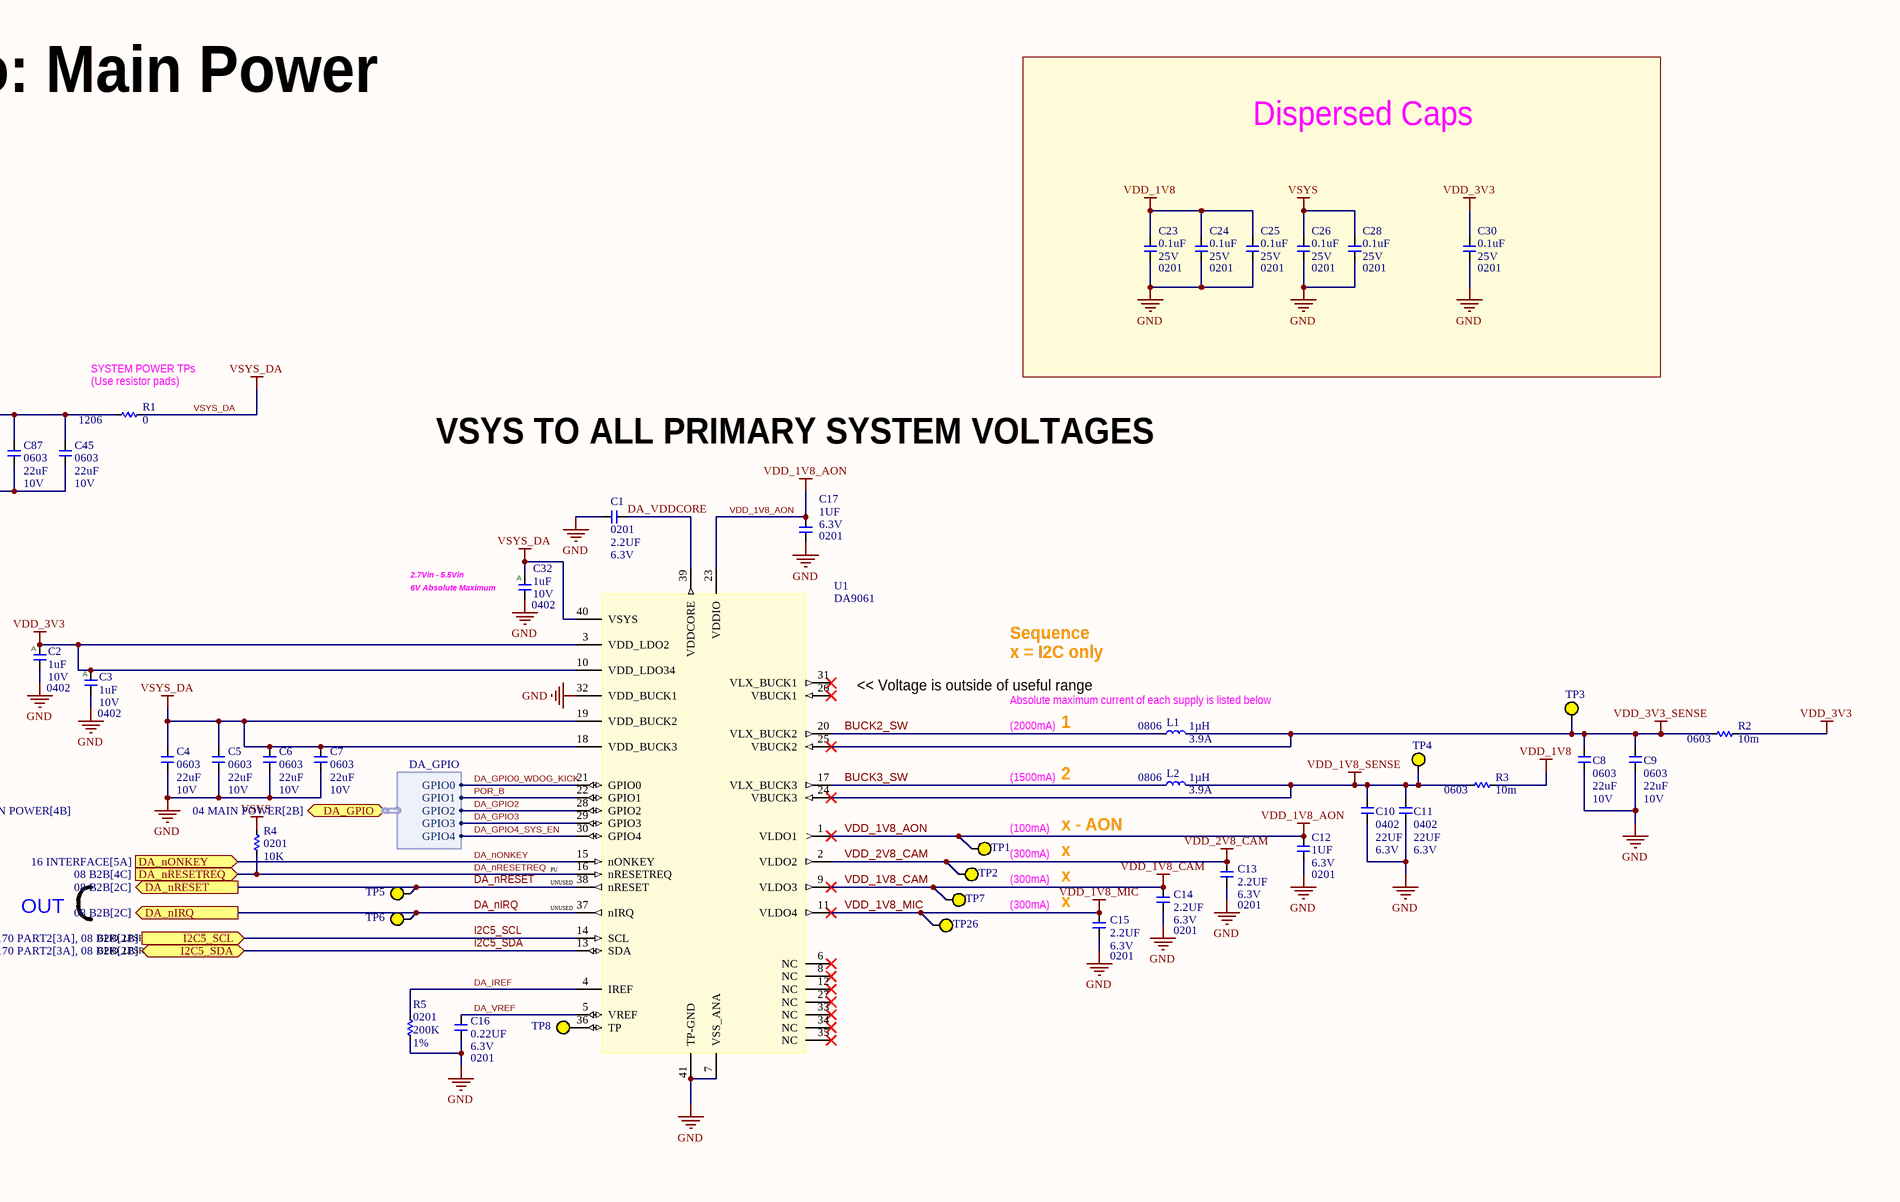
[diagram p6: 04 MAIN POWER.SchDoc, right]

### Parts
C1  value 2.2UF  Package: 0201  Voltage: 6.3V  [C0201_H0.39MM]  (hidden comment: __Template_Cap)
C2  value 1uF  Package: 0402  Voltage: 10V  [C0402]  (hidden comment: __Template_Cap_Auto)
C3  value 1uF  Package: 0402  Voltage: 10V  [C0402]  (hidden comment: __Template_Cap_Auto)
C4  value 22uF  Package: 0603  Voltage: 10V  [C0603]  (hidden comment: __Template_Cap)
C5  value 22uF  Package: 0603  Voltage: 10V  [C0603]  (hidden comment: __Template_Cap)
C6  value 22uF  Package: 0603  Voltage: 10V  [C0603]  (hidden comment: __Template_Cap)
C7  value 22uF  Package: 0603  Voltage: 10V  [C0603]  (hidden comment: __Template_Cap)
C8  value 22uF  Package: 0603  Voltage: 10V  [C0603]  (hidden comment: __Template_Cap)
C9  value 22uF  Package: 0603  Voltage: 10V  [C0603]  (hidden comment: __Template_Cap)
C10  value 22UF  Package: 0402  Voltage: 6.3V  [C0402]  (hidden comment: __Template_Cap)
C11  value 22UF  Package: 0402  Voltage: 6.3V  [C0402]  (hidden comment: __Template_Cap)
C12  value 1UF  Package: 0201  Voltage: 6.3V  [C0201_H0.39MM]  (hidden comment: __Template_Cap)
C13  value 2.2UF  Package: 0201  Voltage: 6.3V  [C0201_H0.39MM]  (hidden comment: __Template_Cap)
C14  value 2.2UF  Package: 0201  Voltage: 6.3V  [C0201_H0.39MM]  (hidden comment: __Template_Cap)
C15  value 2.2UF  Package: 0201  Voltage: 6.3V  [C0201_H0.39MM]  (hidden comment: __Template_Cap)
C16  value 0.22UF  Package: 0201  Voltage: 6.3V  [C0201]  (hidden comment: __Template_Cap)
C17  value 1UF  Package: 0201  Voltage: 6.3V  [C0201_H0.39MM]  (hidden comment: __Template_Cap)
C23  value 0.1uF  Package: 0201  Voltage: 25V  [C0201Y]  (hidden comment: __Template_Cap)
C24  value 0.1uF  Package: 0201  Voltage: 25V  [C0201Y]  (hidden comment: __Template_Cap)
C25  value 0.1uF  Package: 0201  Voltage: 25V  [C0201Y]  (hidden comment: __Template_Cap)
C26  value 0.1uF  Package: 0201  Voltage: 25V  [C0201Y]  (hidden comment: __Template_Cap)
C28  value 0.1uF  Package: 0201  Voltage: 25V  [C0201Y]  (hidden comment: __Template_Cap)
C30  value 0.1uF  Package: 0201  Voltage: 25V  [C0201Y]  (hidden comment: __Template_Cap)
C32  value 1uF  Package: 0402  Voltage: 10V  [C0402]  (hidden comment: __Template_Cap_Auto)
C38  value 22uF  Package: 0603  Voltage: 10V  [C0603]  (hidden comment: __Template_Cap)
C45  value 22uF  Package: 0603  Voltage: 10V  [C0603]  (hidden comment: __Template_Cap)
C87  value 22uF  Package: 0603  Voltage: 10V  [C0603]  (hidden comment: __Template_Cap)
D4  value RBS2MM40CTR  Current - Average Rectified (IO): 2A  [SOD123_AK]  (hidden comment: __Template_DIODE_SCHOTTKY)
L1  value 1µH  Package: 0806  Isat: 3.9A  [L2016_H1.0MM]  (hidden comment: __Template_Inductor)
L2  value 1µH  Package: 0806  Isat: 3.9A  [L2016_H1.0MM]  (hidden comment: __Template_Inductor)
R1  value 0  Package: 1206  [R1206]
R2  value 10m  Package: 0603  [R0603]
R3  value 10m  Package: 0603  [R0603]
R4  value 10K  Package: 0201  [R0201]
R5  value 200K  Package: 0201  Tolerance: 1%  [R0201]
R6  value 49.9  Package: 0201  [R0201]
R7  value 100K  Package: 0201  [R0201]
R8  value 0  Package: 0603  [R0603]
R9  value 1M  Package: 0201  [R0201]
R15  value 0  Package: 0603  [R0603]
TP1  TESTPAD_30MIL  [TESTPAD_SMT_30MIL]  (value not drawn)  (no BOM)
TP2  TESTPAD_30MIL  [TESTPAD_SMT_30MIL]  (value not drawn)  (no BOM)
TP3  TESTPAD_30MIL  [TESTPAD_SMT_30MIL]  (value not drawn)  (no BOM)
TP4  TESTPAD_30MIL  [TESTPAD_SMT_30MIL]  (value not drawn)  (no BOM)
TP5  TESTPAD_30MIL  [TESTPAD_SMT_30MIL]  (value not drawn)  (no BOM)
TP6  TESTPAD_30MIL  [TESTPAD_SMT_30MIL]  (value not drawn)  (no BOM)
TP7  TESTPAD_30MIL  [TESTPAD_SMT_30MIL]  (value not drawn)  (no BOM)
TP8  TESTPAD_30MIL  [TESTPAD_SMT_30MIL]  (value not drawn)  (no BOM)
TP26  TESTPAD_30MIL  [TESTPAD_SMT_30MIL]  (value not drawn)  (no BOM)
TP27  TESTPAD_30MIL  [TESTPAD_SMT_30MIL]  (value not drawn)  (no BOM)
U1  MFG P/N: DA9061  [QFN50P600X600X90-40-TP]  (hidden comment: PMIC_DIALOG_SEMI_DA9061)

### Blocks framed on the sheet
Dispersed Caps: C23-C26 C28 C30

### Ports
DA_GPIO0 (bidir, see 05 MIMXRT1170 PART1[6A], 08 B2B[2C]), DA_GPIO2 (bidir, see 08 B2B[2C]), DA_GPIO3 (bidir, see 08 B2B[2C]), DA_GPIO4 (bidir, see 08 B2B[2C]), DA_GPIO (bidir, harness DA_GPIO, see 04 MAIN POWER[2B]), DA_GPIO (bidir, harness DA_GPIO, see 04 MAIN POWER[4B]), DA_nIRQ (out, see 08 B2B[2C]), DA_nONKEY (in, see 16 INTERFACE[5A]), DA_nRESET (out, see 08 B2B[2C]), DA_nRESETREQ (in, see 08 B2B[4C]), I2C5_SCL (in, see 06 MIMXRT1170 PART2[1C], 06 MIMXRT1170 PART2[3A], 08 B2B[2B]), I2C5_SDA (bidir, see 06 MIMXRT1170 PART2[1C], 06 MIMXRT1170 PART2[3A], 08 B2B[2B]), PMIC_ON_REQ (bidir, see 05 MIMXRT1170 PART1[5A], 08 B2B[2B]), POR_B (bidir, see 05 MIMXRT1170 PART1[6A], 08 B2B[4C], 16 INTERFACE[5B])

### Harnesses
DA_GPIO: GPIO0, GPIO1, GPIO2, GPIO3, GPIO4

### Nets
DCDC_1V8_OUT: R7.2
GND: C1.1 C2.2 C3.2 C4.2 C5.2 C6.2 C7.2 C8.2 C9.2 C10.2 C11.2 C12.2 C13.2 C14.2 C15.2 C16.2 C17.2 C23.2 C24.2 C25.2 C26.2 C28.2 C30.2 C32.2 C38.2 C45.2 C87.2 R5.1 R9.1 U1.7(VSS_ANA) U1.32(VDD_BUCK1) U1.41(TP-GND)
VDD_1V8: C23.1 C24.1 C25.1 R3.2
VDD_1V8_AON: C12.1 C17.1 TP1.1 U1.1(VLDO1) U1.23(VDDIO)
VDD_1V8_CAM: C14.1 TP7.1 U1.9(VLDO3)
VDD_1V8_MIC: C15.1 TP26.1 U1.11(VLDO4)
VDD_1V8_SENSE: C10.1 C11.1 L2.2 R3.1 TP4.1 U1.24(VBUCK3)
VDD_2V8_CAM: C13.1 TP2.1 U1.2(VLDO2)
VDD_3V3: C2.1 C3.1 C30.1 R2.2 U1.3(VDD_LDO2) U1.10(VDD_LDO34)
VDD_3V3_SENSE: C8.1 C9.1 L1.2 R2.1 TP3.1 U1.25(VBUCK2)
VSYS: C26.1 C28.1 C38.1 C45.1 C87.1 D4.K R1.1 R4.2 R15.1
VSYS_DA: C4.1 C5.1 C6.1 C7.1 C32.1 R1.2 U1.18(VDD_BUCK3) U1.19(VDD_BUCK2) U1.40(VSYS)
VUSB: R8.2
BUCK2_SW: L1.1 U1.20(VLX_BUCK2)
BUCK3_SW: L2.1 U1.17(VLX_BUCK3)
DA_GPIO0_WDOG_KICK: TP27.1 U1.21(GPIO0) ; port DA_GPIO0, port DA_GPIO.GPIO0
DA_GPIO2: U1.28(GPIO2) ; port DA_GPIO2, port DA_GPIO.GPIO2
DA_GPIO3: U1.29(GPIO3) ; port DA_GPIO3, port DA_GPIO.GPIO3
DA_GPIO4_SYS_EN: R6.2 R7.1 R9.2 U1.30(GPIO4) ; port DA_GPIO4, port DA_GPIO.GPIO4
DA_IREF: R5.2 U1.4(IREF)
DA_nIRQ: TP6.1 U1.37(nIRQ) ; port DA_nIRQ
DA_nONKEY: U1.15(nONKEY) ; port DA_nONKEY
DA_nRESET: TP5.1 U1.38(nRESET) ; port DA_nRESET
DA_nRESETREQ: R4.1 U1.16(nRESETREQ) ; port DA_nRESETREQ
DA_VDDCORE: C1.2 U1.39(VDDCORE)
DA_VREF: C16.1 U1.5(VREF)
I2C5_SCL: U1.14(SCL) ; port I2C5_SCL
I2C5_SDA: U1.13(SDA) ; port I2C5_SDA
PMIC_ON_REQ: R6.1 ; port PMIC_ON_REQ
POR_B: U1.22(GPIO1) ; port POR_B, port DA_GPIO.GPIO1
VUSB_R: D4.A R8.1 R15.2
NetTP8_1: TP8.1 U1.36(TP)

Not connected (* = marked no-connect by the designer): U1 6(NC)* 8(NC)* 12(NC)* 26(VBUCK1)* 27(NC)* 31(VLX_BUCK1)* 33(NC)* 34(NC)* 35(NC)*

### Layout directives
net class Power: VBAT, VSYS, VSYS_DA

### Notes on the sheet
- Coral Dev Board Micro: Main Power
- (near R1) SYSTEM POWER TPs
- (near R8) DEPOP to REMOVE
- (near R1) (Use resistor pads)
- (near R8) USB POWER PATH
- VSYS TO ALL PRIMARY SYSTEM VOLTAGES
- (near R15) Protection diode bypass resistor (for USB port)
- 2.7Vin - 5.5Vin
- (near C32) 6V Absolute Maximum
- WDOG_KICK Optional by customer
- << Voltage is outside of useful range
- Sequence
- x = I2C only
- DA_GPIO0 can be programmed for watchdog use. Consult the DA9061 Datasheet
- (2000mA)
- (near L1) Absolute maximum current of each supply is listed below
- 1
- DA_GPIO2
- DA_GPIO3
- DA_GPIO1
- DA_GPIO0
- (1500mA)
- 2
- DA_GPIO4 - SYS_EN
- (near U1) PU
- (near U1) UNUSED
- (near TP1) (100mA)
- (300mA)
- x - AON
- x
- (near C15) x
- OUT
- GPIO_LPSR_04
- GPIO_LPSR_05
- Power Control Via Enable (PMIC)
- Any TRANSITION on SYS_EN (GPIO4) up or down will cause the DA9061 to smoothly sequence the rails up or down to enter the associated state if it's not already there
- Truth Table
  OFF & RISE | Sequence UP
  OFF & FALL | NOTHING (Stays OFF)
  ON  & RISE | NOTHING (Stays ON )
  ON  & FALL | Sequence DOWN
- PMIC_ON_REQ
- Labels drawn without touching a wire or pin: VBAT, VSYS, VSYS_DA
- Title
- Size:
- Date:
- File:
- A2
- Number:
- Time:
- Revision:
- Sheet
- of
- (in symbol 26) A

### Library data of the parts
C1 C13-C15 = 1761: CAP, CER, X5R, 2.2uF, 20%, 6.3V, 0201, 0.39mm; ID: 1761; MFG: YAGEO; MFG P/N: CC0201MRX5R5BB225; EPIC: G150-01316-00; Status: In Development; Dielectric: X5R; Tolerance: 20%; Height: 0.39mm; Supplier 1: Digi-Key; HelpURL: https://www.digikey.com/product-detail/en/yageo/CC0201MRX5R5BB225/311-3473-1-ND/7164494; ComponentLink1Description: Datasheet; ComponentLink1URL: http://www.yageo.com/documents/recent/UPY-GPHC_X5R_4V-to-50V_25.pdf; Supplier Part Number 1: 311-3473-1-ND
C2 C3 C32 = 26: CAP, CER, X5R, 1uF, 10V, 10%, 0402, AUTOGRADE; ID: 26; MFG: Taiyo Yuden; MFG P/N: LMK105BJ105KVHF; XPN: 150-01126-00; PROXY: Use ID #574; Gecko: 150-04432-00; Status: Released; Dielectric: X5R; Tolerance: 10%; Height: 0.55mm; Supplier 1: Digi-Key; ComponentLink1Description: Datasheet; COMMON: 150-01126-00; Supplier Part Number 1: 587-3712-1-ND
C4-C9 C38 C45 C87 = 108: CAP, CER, X5R, 22uF, 20%, 10V, 0603; ID: 108; MFG: TDK; MFG P/N: C1608X5R1A226M080AC; XPN: 150-00202-00; PROXY: Use ID #452; Status: Released; Dielectric: X5R; Tolerance: 20%; Height: 1mm; ComponentLink1Description: Datasheet; COMMON: 150-00202-00
C10 C11 = 1719: CAP, CER, X5R, 22uF, 20%, 6.3V, 0402; ID: 1719; MFG: AVX; MFG P/N: 04026D226MAT2A; XPN: 150-00420-00; PROXY: 150-03491-00; Status: Released; Dielectric: X5R; Tolerance: 20%; Height: 0.70mm; Supplier 1: Digi-Key; HelpURL: https://www.digikey.in/product-detail/en/avx-corporation/04026D226MAT2A/478-9839-1-ND/5964924; ComponentLink1Description: Datasheet; ComponentLink1URL: http://datasheets.avx.com/cx5r.pdf; COMMON: 150-00420-00; LOON: 150-00420-00; Gecko: 150-00420-00; Supplier Part Number 1: 478-9839-1-ND
C12 C17 = 1771: CAP, CER, X6S, 1uF, 20%, 6.3V, 0201, 0.39mm; ID: 1771; MFG: MURATA; MFG P/N: GRM033C80J105ME05D; EPIC: G150-02531-00; Status: In Development; Dielectric: X6S; Tolerance: 20%; Height: 0.39mm; Supplier 1: Digi-Key; HelpURL: https://www.digikey.com/product-detail/en/murata-electronics-north-america/GRM033C80J105ME05D/490-13218-1-ND/5877426; ComponentLink1Description: Datasheet; ComponentLink1URL: https://psearch.en.murata.com/capacitor/product/GRM033C80J105ME05%23.pdf; Supplier Part Number 1: 490-13218-1-ND
C16 = 983: CAP, CER, X5R, 0.22uF, 6.3V, 10%, 0201, 0.33mm T; ID: 983; MFG: TDK; MFG P/N: C0603X5R0J224K030BB; XPN: 150-00425-00; Status: NRND; Dielectric: X5R; Tolerance: 10%; Height: 0.33mm T; ComponentLink1Description: Datasheet; COMMON: 150-00425-00
C23-C26 C28 C30 = 386: CAP, CER, X5R, 0.1uF, 25V, 20%, 0201, 0.33mm T; ID: 386; MFG: MURATA; MFG P/N: GRM033R61E104ME14D; XPN: 150-01204-00; Status: Released; Dielectric: X5R; Tolerance: 20%; Height: 0.33mm T; ComponentLink1Description: Datasheet; COMMON: 150-01204-00; LOON: 150-01204-00; Gecko: 150-01204-00
D4 = 348: DIODE, SCHOTTKY, 20V VRRM, 2A IO, 45A SURGE, SOD-123F; ID: 348; MFG: Rohm Semiconductor; Voltage – Forward (VF) (MAX) @ IF: 390 mV @ 2 A; Current - Reverse Leakage @ VR: 600 µA @ 20 V; Status: Released; MFG P/N: RBS2MM40CTR; Package: SOD-123F; Category: DIODE; RoHS Compliant: Yes; Diode Type: Schottky; Mounting Type: SMD; Voltage - DC Reverse (VR) (MAX): 20V; Operating Temperature – Junction: 125°C; Supplier 1: Digi-Key; HelpURL: https://www.digikey.com/en/products/detail/rohm-semiconductor/RBS2MM40CTR/13547997?s=N4IgTCBcDaIEoCEDKYCyqAsAGAwgFThAF0BfIA; ComponentLink1Description: Datasheet; ComponentLink1URL: https://fscdn.rohm.com/en/products/databook/datasheet/discrete/diode/schottky_barrier/rbs2mm40ctr-e.pdf; Height: 0.9mm; Supplier Part Number 1: 846-RBS2MM40CTR-ND
L1 L2 = 881: IND, PWR, FILM, 1uH, 20%, 3.9A Isat, 3.1A Idc, 0.056 DCR, 2016m, 1.00mm; ID: 881; Catagory: Fixed Inductors; MFG: TDK; MFG P/N: TFM201610ALM-1R0MTAA; Tolerance: 20; L Test Freq: 1MHz; Rdc max: 56mOhm Max; EPIC: G180-01867-00; ComponentLink1Description: Datasheet; Status: In Development; Supplier 1: Digi-Key; HelpURL: https://www.digikey.com/product-detail/en/tdk-corporation/TFM201610ALM-1R0MTAA/445-174185-1-ND/5812325; ComponentLink1URL: https://product.tdk.com/info/en/catalog/datasheets/inductor_commercial_power_tfm201610alm_en.pdf; Supplier Part Number 1: 445-174185-1-ND
R1 = 5: RES, 0, 5%, 1/4W, 1206; ID: 5; MFG: ROHM; MFG P/N: MCR18EZHJ000; COMMON: 470-03592-00; PROXY: 470-16245-00; XPN: XS-10014547; Status: NRND; Power: 1/4W; Tolerance: 5%; Height: 0.65mm; Supplier 1: Digi-Key; LOON: 470-03592-00; Gecko: 470-03592-00; Supplier Part Number 1: RHM0.0ECT-ND
R2 R3 = 191: Resistor, 10.0m Ohms, 0603, 0.1W, ±1%; ID: 191; MFG: VISHAY; MFG P/N: WSL0603R0100FEA; Power: 1/10W; COMMON: 470-00380-00; Status: Released; Tolerance: 1%; Height: 0.46mm; Supplier 1: Digi-Key; LOON: 470-00380-00; Gecko: 470-00380-00; XPN: 470-00380-00; Supplier Part Number 1: WSLJ-.01CT-ND
R4 = 4151: RES, 10K, 1%, 1/20W, 0201; ID: 4151; MFG: YAGEO; MFG P/N: RC0201FR-0710KL; COMMON: 470-00033-00; PROXY: 470-16076-00; Status: Released; Power: 1/20W; Tolerance: 1%; Height: 0.26mm; Supplier 1: Digi-Key; LOON: 470-00033-00; Gecko: 470-00033-00; XPN: 470-00033-00; Supplier Part Number 1: 311-10.0KMCT-ND
R5 = 5211: Resistor, 200K Ohms, 0201, 0.05W, ±1%; ID: 5211; MFG: VISHAY; MFG P/N: CRCW0201200KFKED; Power: 1/20W; COMMON: 470-00808-00; Status: Released; Height: 0.28mm; Supplier 1: Digi-Key; LOON: 470-00808-00; Gecko: 470-00808-00; XPN: 470-00808-00; Supplier Part Number 1: 541-200KAABCT-ND
R6 = 2114: RES, 49.9, 1%, 1/20W, 0201; ID: 2114; MFG: PANASONIC; MFG P/N: ERJ-1GEF49R9C; COMMON: 470-00007-00; PROXY: Alt ID #6310; Status: NRND; Power: 1/20W; Tolerance: 1%; Height: 0.26mm; Supplier 1: Digi-Key; XPN: 470-00007-00; Supplier Part Number 1: P49.9ABCT-ND
R7 = 7818: RES, 100K, 1%, 1/20W, 0201; ID: 7818; MFG: PANASONIC; MFG P/N: ERJ1GEF1003C; COMMON: 470-00506-00; Status: NRND; Power: 1/20W; Tolerance: 1%; LOON: 470-00506-00; Gecko: 470-00506-00; XPN: 470-00506-00
R8 R15 = 6701: RES, 0, JUMPER, 1/8W, 0603; ID: 6701; MFG: VISHAY; MFG P/N: MCT06030Z0000ZP500; COMMON: 470-02384-00; PROXY: 470-16006-00; Gecko: 470-17718-00; Status: Released; Power: 1/8W; Tolerance: JUMPER; LOON: 470-02384-00; XPN: 470-02384-00
  R15: DNP: DNP
R9 = 7806: RES, 1M, 1%, 1/20W, 0201; ID: 7806; MFG: PANASONIC; MFG P/N: ERJ1GEF1004C; COMMON: 470-00029-00; Status: NRND; Power: 1/20W; Tolerance: 1%; LOON: 470-00029-00; Gecko: 470-00029-00; XPN: 470-00029-00
TP1-TP8 TP26 TP27 = 178: TESTPAD_SMT_30MIL; ID: 178; MFG: _PCB Feature; Status: Released; ComponentLink1URL: _PCB Feature
U1 = 770: IC, PWR MANAGEMENT, DA9061, DDR, BUCK, LDO, 2.7 TO 5.5 VIN, SMD; ID: 770; MFG: Dialog Semiconductor; Status: Released; Package: 40-QFN; Category: Integrated Circuits (ICs); RoHS Compliant: Yes; ComponentLink1URL: https://drive.google.com/a/google.com/file/d/1gaatOYX1-uBj1SMvDyL_BcuT9Czf3Mnn/view?usp=sharing; Mounting Type: SMD; Height: 0.9mm